# Altium schematic sheet PWM_OUT.SchDoc
size A4
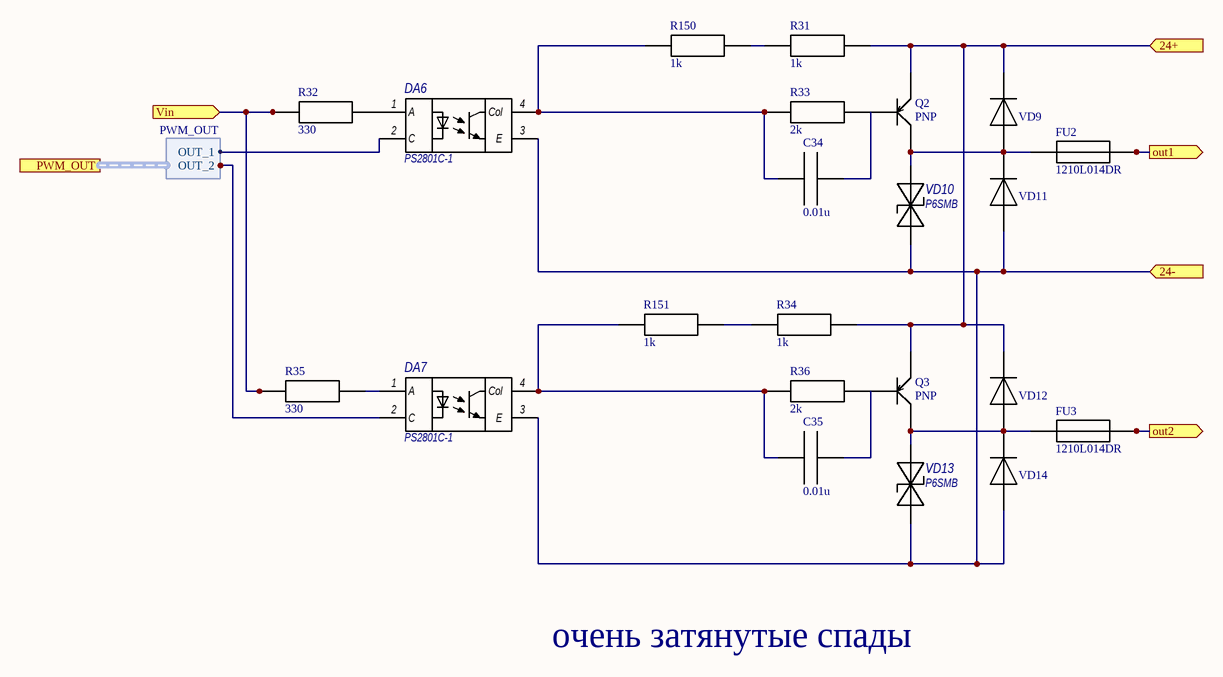
[diagram p0: PWM_OUT.SchDoc]

## Parts
C34  0.01u  [cap_0402]
C35  0.01u  [cap_0402]
DA6  PS2801C-1  [SSOP-4N]
DA7  PS2801C-1  [SSOP-4N]
FU2  1210L014DR  [fuse1210]
FU3  1210L014DR  [fuse1210]
Q2  PNP  [sot23]
Q3  PNP  [sot23]
R31  1k  [0805-res]
R32  330  [res_0402]
R33  2k  [res_0402]
R34  1k  [0805-res]
R35  330  [res_0402]
R36  2k  [res_0402]
R150  1k  [0805-res]
R151  1k  [0805-res]
VD9  1N4448  [sod-323]  (value not drawn)
VD10  Type: P6SMB  [SOD-123]  (hidden comment: PTVS33VS1UTR)
VD11  1N4448  [sod-323]  (value not drawn)
VD12  1N4448  [sod-323]  (value not drawn)
VD13  Type: P6SMB  [SOD-123]  (hidden comment: PTVS33VS1UTR)
VD14  1N4448  [sod-323]  (value not drawn)

## Ports
24+ (in), 24- (in), out1 (out), out2 (out), PWM_OUT (harness PWM_OUT), Vin (in)

## Harnesses
PWM_OUT: OUT_1, OUT_2

## Nets
24+: Q2.3(K) Q3.3(K) R31.2 R34.2 VD9.K VD12.K ; port 24+
24-: DA6.3(E) DA7.3(E) VD10.A VD11.A VD13.A VD14.A ; port 24-
out1: FU2.2 ; port out1
out2: FU3.2 ; port out2
Vin: R32.1 R35.1 ; port Vin
NetC34_1: C34.1 DA6.4(Col) R33.1 R150.1
NetC34_2: C34.2 Q2.1(B) R33.2
NetC35_1: C35.1 DA7.4(Col) R36.1 R151.1
NetC35_2: C35.2 Q3.1(B) R36.2
NetDA6_1: DA6.1(A) R32.2
NetDA6_2: DA6.2(C) ; port PWM_OUT.OUT_1
NetDA7_1: DA7.1(A) R35.2
NetDA7_2: DA7.2(C) ; port PWM_OUT.OUT_2
NetFU2_1: FU2.1 Q2.2(E) VD9.A VD10.K VD11.K
NetFU3_1: FU3.1 Q3.2(E) VD12.A VD13.K VD14.K
NetR31_1: R31.1 R150.2
NetR34_1: R34.1 R151.2

## Notes on the sheet
- очень затянутые спады

## Library data of the parts
C34 C35 = cap
FU2 FU3 = fuse
R31-R36 R150 R151 = res
VD10 VD13 = PTVS33VS1UTR: PTVS33VS1UTR,115, TVS DIODE 33VWM 53.3VC SOD123W
DA6 DA7 = PS2801C-1: Type: PS2801C-1